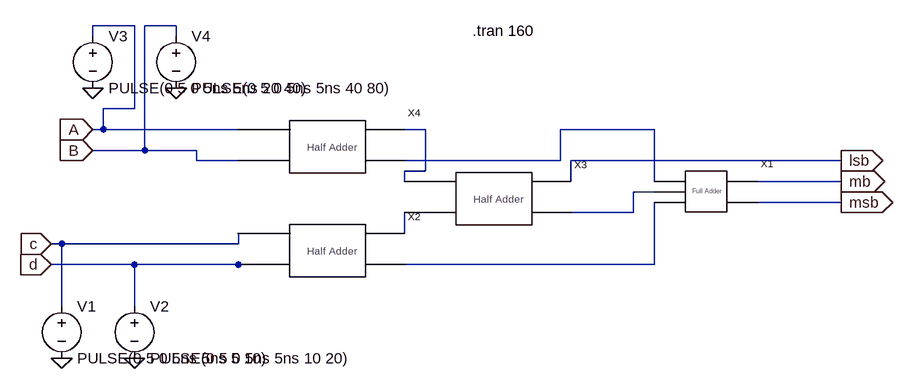
[diagram p0: schematic 4_bitaader.asc]
4_bitaader.asc, the LTspice schematic file:
Version 4
SHEET 1 1024 680
WIRE -176 -432 -240 -432
WIRE -112 -432 -160 -432
WIRE -240 -416 -240 -432
WIRE -112 -416 -112 -432
WIRE -176 -304 -176 -432
WIRE -176 -304 -224 -304
WIRE -224 -272 -224 -304
WIRE -224 -272 -240 -272
WIRE -16 -272 -224 -272
WIRE 272 -272 240 -272
WIRE 624 -272 480 -272
WIRE -160 -240 -160 -432
WIRE -160 -240 -240 -240
WIRE -80 -240 -160 -240
WIRE -80 -224 -80 -240
WIRE -16 -224 -80 -224
WIRE 480 -224 480 -272
WIRE 480 -224 240 -224
WIRE 912 -224 496 -224
WIRE 272 -208 272 -272
WIRE 272 -208 240 -208
WIRE 240 -192 240 -208
WIRE 496 -192 496 -224
WIRE 624 -192 624 -272
WIRE 912 -192 784 -192
WIRE 624 -176 592 -176
WIRE 912 -160 784 -160
WIRE 592 -144 592 -176
WIRE 592 -144 496 -144
WIRE 240 -112 240 -144
WIRE -288 -96 -304 -96
WIRE -16 -96 -16 -112
WIRE -16 -96 -288 -96
WIRE -176 -64 -304 -64
WIRE -16 -64 -176 -64
WIRE 0 -64 -16 -64
WIRE 624 -64 624 -160
WIRE 624 -64 240 -64
WIRE -288 0 -288 -96
WIRE -176 0 -176 -64
FLAG -304 -96 c
IOPIN -304 -96 In
FLAG -304 -64 d
IOPIN -304 -64 In
FLAG 912 -224 lsb
IOPIN 912 -224 Out
FLAG 912 -160 msb
IOPIN 912 -160 Out
FLAG -240 -272 A
IOPIN -240 -272 In
FLAG -240 -240 B
IOPIN -240 -240 In
FLAG -240 -336 0
FLAG -112 -336 0
FLAG -288 80 0
FLAG -176 80 0
FLAG 912 -192 mb
IOPIN 912 -192 Out
SYMBOL half_adder 128 -240 R0
SYMATTR InstName X4
SYMBOL voltage -288 -16 R0
WINDOW 123 0 0 Left 0
WINDOW 39 0 0 Left 0
SYMATTR InstName V1
SYMATTR Value PULSE(0 5 0 5ns 5ns 5 10)
SYMBOL voltage -176 -16 R0
WINDOW 123 0 0 Left 0
WINDOW 39 0 0 Left 0
SYMATTR InstName V2
SYMATTR Value PULSE(0 5 0 5ns 5ns 10 20)
SYMBOL voltage -240 -432 R0
WINDOW 123 0 0 Left 0
WINDOW 39 0 0 Left 0
SYMATTR InstName V3
SYMATTR Value PULSE(0 5 0 5ns 5ns 20 40)
SYMBOL voltage -112 -432 R0
WINDOW 123 0 0 Left 0
WINDOW 39 0 0 Left 0
SYMATTR InstName V4
SYMATTR Value PULSE(0 5 0 5ns 5ns 40 80)
SYMBOL half_adder 128 -80 R0
SYMATTR InstName X2
SYMBOL half_adder 384 -160 R0
SYMATTR InstName X3
SYMBOL full_adder 704 -176 R0
SYMATTR InstName X1
TEXT 344 -424 Left 2 !.tran 160

The netlist it stands for:
* 4_bitaader.asc
XX4 A B N001 N002 half_adder  ; pins A B Sum carry
V1 c 0 PULSE(0 5 0 5ns 5ns 5 10)
V2 d 0 PULSE(0 5 0 5ns 5ns 10 20)
V3 A 0 PULSE(0 5 0 5ns 5ns 20 40)
V4 B 0 PULSE(0 5 0 5ns 5ns 40 80)
XX2 c d N004 N005 half_adder  ; pins A B Sum carry
XX3 N001 N004 lsb N003 half_adder  ; pins A B Sum carry
XX1 N002 N003 N005 msb mb full_adder  ; pins A B Cin Cout Sum
.tran 160
.backanno
.end